# EAGLE design 411RoughDraft (EAGLE 9.5.1)
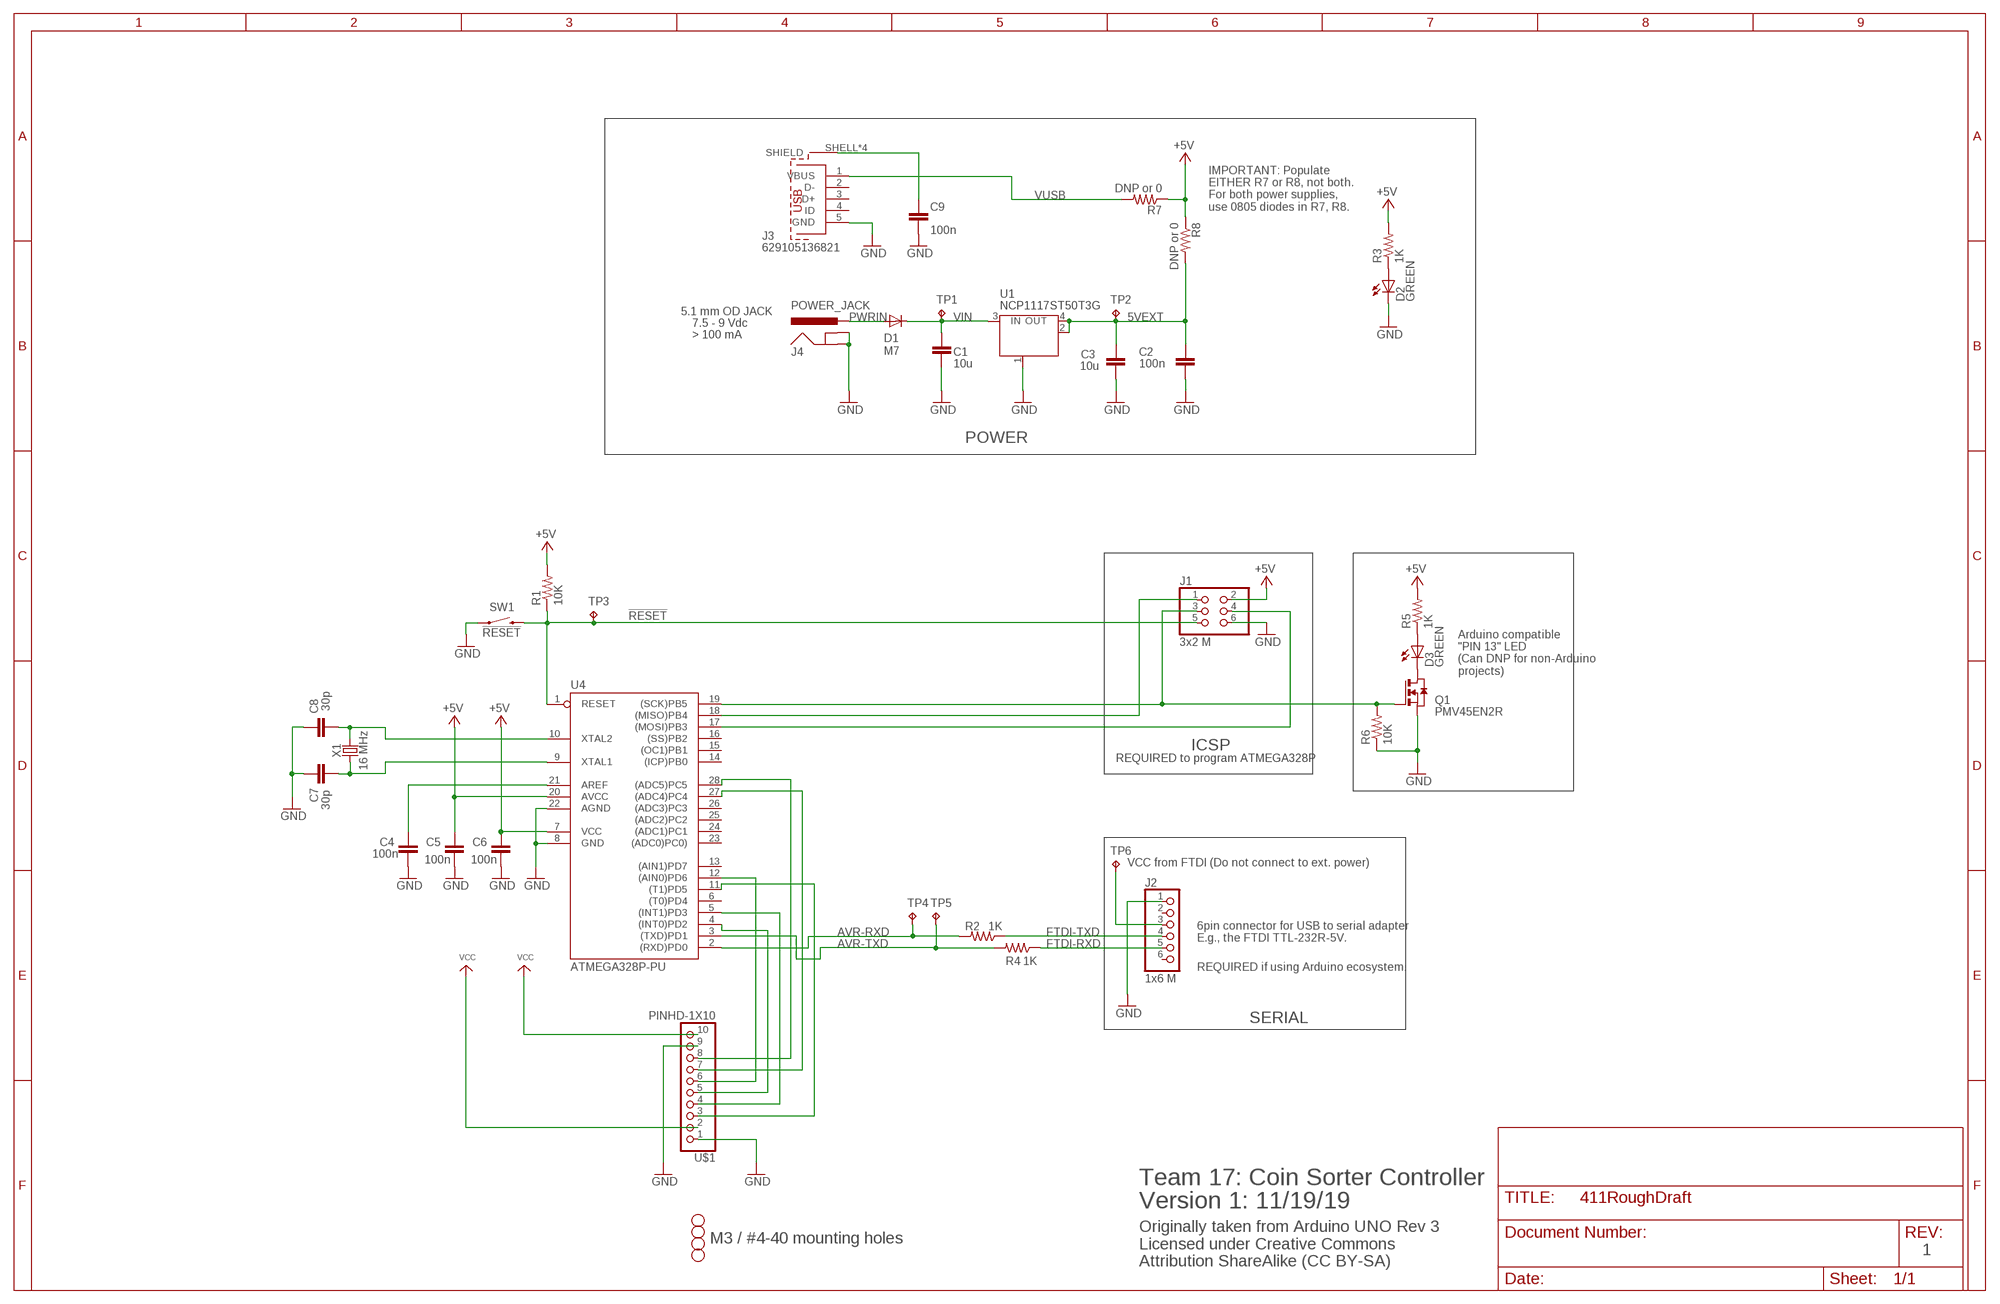
[diagram p0: schematic, sheet 1]

## Parts
C1  10u  C-EUC0805K  [C0805K]
C2  100n  C-EUC0805K  [C0805K]
C3  10u  C-EUC0805K  [C0805K]
C4  100n  C-EUC0805K  [C0805K]
C5  100n  C-EUC0805K  [C0805K]
C6  100n  C-EUC0805K  [C0805K]
C7  30p  C-EUC0805K  [C0805K]
C8  30p  C-EUC0805K  [C0805K]
C9  100n  C-EUC0805K  [C0805K]
D1  M7  DIODE-SMB  [SMB]
D2  GREEN  LEDCHIP-LED0805  [CHIP-LED0805]
D3  GREEN  LEDCHIP-LED0805  [CHIP-LED0805]
H1  STAND-OFF  [STAND-OFF]
H2  STAND-OFF  [STAND-OFF]
H3  STAND-OFF  [STAND-OFF]
H4  STAND-OFF  [STAND-OFF]
J1  3x2 M  PINHD-2X3  [2X03]
J2  1x6 M  PINHD-1X6  [1X06]
J3  629105136821  [629105136821]
J4  POWER_JACK  [POWER_JACK_PTH]
Q1  PMV45EN2R  NMOSSOT23  [SOT-23]
R1  10K  R-US_R0805  [R0805]
R2  1K  R-US_R0805  [R0805]
R3  1K  R-US_R0805  [R0805]
R4  1K  R-US_R0805  [R0805]
R5  1K  R-US_R0805  [R0805]
R6  10K  R-US_R0805  [R0805]
R7  DNP or 0  R-US_R0805  [R0805]
R8  DNP or 0  R-US_R0805  [R0805]
SW1  !RESET  SWITCH-MOMENTARY-2SMD  [TACTILE_SWITCH_SMD]
TP1  TPPAD1-13  [P1-13]
TP2  TPPAD1-13  [P1-13]
TP3  TPPAD1-13  [P1-13]
TP4  TPPAD1-13  [P1-13]
TP5  TPPAD1-13  [P1-13]
TP6  TPPAD1-13  [P1-13]
U1  NCP1117ST50T3G  MC33269ST-3.3T3  [SOT223]
U4  ATMEGA328P-PU  [DIL28-3]
U$1  PINHD-1X10  [1X10-BIG]
X1  16 MHz  CRYSTALSMD-HC49UP  [HC49UP]

## Nets
5VEXT: C2.2 C3.1 R8.2 TP2.TP U1.2(OUT) U1.4(OUT)
!RESET: J1.5 R1.1 SW1.3 TP3.TP U4.1(RESET)
+5V: C5.2 C6.2 J1.2 R1.2 R3.2 R5.2 R7.1 R8.1 U4.7(VCC) U4.20(AVCC)
AVR-RXD: R2.2 TP4.TP U4.2((RXD)PD0)
AVR-TXD: R4.2 TP5.TP U4.3((TXD)PD1)
FTDI-RXD: J2.5 R4.1
FTDI-TXD: J2.4 R2.1
GND: C1.2 C2.1 C3.2 C4.1 C5.1 C6.1 C7.2 C8.2 C9.1 D2.C J1.6 J2.1 J3.5(GND) J4.GND J4.GNDBREAK Q1.2(S) R6.1 SW1.1 U1.1(GND/ADJ) U4.8(GND) U4.22(AGND) U$1.1 U$1.9
MISO: J1.1 U4.18((MISO)PB4)
MOSI: J1.4 U4.17((MOSI)PB3)
N$1: C4.2 U4.21(AREF)
N$2: D3.A R5.1
N$3: D2.A R3.1
N$4: D3.C Q1.1(D)
N$5: J2.3 TP6.TP
N$6: C9.2 J3.SHELL1(SHIELD) J3.SHELL2(SHIELD) J3.SHELL3(SHIELD) J3.SHELL(SHIELD)
N$7: U4.27((ADC4)PC4) U$1.7
N$8: U4.12((AIN0)PD6) U$1.6
N$9: U4.4((INT0)PD2) U$1.5
N$10: U4.5((INT1)PD3) U$1.4
N$11: U4.28((ADC5)PC5) U$1.8
N$12: U4.11((T1)PD5) U$1.3
PWRIN: D1.A J4.PWR
SCK: J1.3 Q1.3(G) R6.2 U4.19((SCK)PB5)
VCC: U$1.2 U$1.10
VIN: C1.1 D1.C TP1.TP U1.3(IN)
VUSB: J3.1(VBUS) R7.2
XTAL1: C7.1 U4.9(XTAL1) X1.1
XTAL2: C8.1 U4.10(XTAL2) X1.2
Unconnected: J2.2 J2.6 J3.2(D-) J3.3(D+) J3.4(ID) U4.6((T0)PD4) U4.13((AIN1)PD7) U4.14((ICP)PB0) U4.15((OC1)PB1) U4.16((SS)PB2) U4.23((ADC0)PC0)) U4.24((ADC1)PC1) U4.25((ADC2)PC2) U4.26((ADC3)PC3)

## Notes on the sheet
- IMPORTANT: Populate 
  EITHER R7 or R8, not both.
  For both power supplies,
  use 0805 diodes in R7, R8.
- 5.1 mm OD JACK
- 7.5 - 9 Vdc
- > 100 mA
- POWER
- Arduino compatible
  "PIN 13" LED
  (Can DNP for non-Arduino
  projects)
- ICSP
- REQUIRED to program ATMEGA328P
- VCC from FTDI (Do not connect to ext. power)
- 6pin connector for USB to serial adapter
  E.g., the FTDI TTL-232R-5V.
- REQUIRED if using Arduino ecosystem.
- SERIAL
- Team 17: Coin Sorter Controller
- Version 1: 11/19/19
- M3 / #4-40 mounting holes
- 1
- Originally taken from Arduino UNO Rev 3
  Licensed under Creative Commons 
  Attribution ShareAlike (CC BY-SA)

## Library data of the parts
C1 C3 = rcl:C-EU: CAPACITOR, European symbol; MFR: Samsung; MPN: CL21A106KOQNNNG; SPICEPREFIX: C
C2 C4-C6 C9 = rcl:C-EU: CAPACITOR, European symbol; MFR: Samsung; MPN: CL21B104KBCNNNC; SPICEPREFIX: C
C7 = rcl:C-EU: CAPACITOR, European symbol; DESC: CAP CER 30PF 50V C0G/NP0 0805; MFR: Samsung; MPN: CL21C180JBANNNC; SPICEPREFIX: C
C8 = rcl:C-EU: CAPACITOR, European symbol; DESC: CAP CER 30PF 50V C0G/NP0 0805; MFR: Samsung; MPN: CL21C300JBANNNC; SPICEPREFIX: C
D1 = diode:DIODE-: DIODE; MFR: SMC Diode; MPN: 10BQ030TR
D2 D3 = led:LED: LED OSRAM: - CHIPLED LG R971, LG N971, LY N971, LG Q971, LY Q971, LO R971, LY R971 LH N974, LH R974 LS Q976, LO Q976, LY Q976 LO Q996 - Hyper CHIPLED LW Q18S LB Q993, LB Q99A, LB R99A - SideLED LS A670, LO A670, LY A670, LG A670, LP A670 LB A673, LV A673, LT A673, LW A673 LH A674 LY A675 LS A676, LA A676, LO A676, LY A676, LW A676 LS A679, LY A679, LG A679 - Hyper Micro SIDELED® LS Y876, LA Y876, LO Y876, LY Y876 LT Y87S - SmartLED LW L88C, LW L88S LB L89C, LB L89S, LG L890 LS L89K, LO L89K, LY L89K LS L896, LA L896, LO L896, LY L896 - TOPLED LS T670, LO T670, LY T670, LG T670, LP T670 LSG T670, LSP T670, LSY T670, LOP T670, LYG T670 LG T671, LOG T671, LSG T671 LB T673, LV T673, LT T673, LW T673 LH T674 LS T676, LA T676, LO T676, LY T676, LB T676, LH T676, LSB T676, LW T676 LB T67C, LV T67C, LT T67C, LS T67K, LO T67K, LY T67K, LW E67C LS E67B, LA E67B, LO E67B, LY E67B, LB E67C, LV E67C, LT E67C LW T67C LS T679, LY T679, LG T679 LS T770, LO T770, LY T770, LG T770, LP T770 LB T773, LV T773, LT T773, LW T773 LH T774 LS E675, LA E675, LY E675, LS T675 LS T776, LA T776, LO T776, LY T776, LB T776 LHGB T686 LT T68C, LB T68C - Hyper Mini TOPLED® LB M676 - Mini TOPLED Santana® LG M470 LS M47K, LO M47K, LY M47K Source: http://www.osram.convergy.de LUXEON: - LUMILED® LXK2-PW12-R00, LXK2-PW12-S00, LXK2-PW14-U00, LXK2-PW14-V00 LXK2-PM12-R00, LXK2-PM12-S00, LXK2-PM14-U00 LXK2-PE12-Q00, LXK2-PE12-R00, LXK2-PE12-S00, LXK2-PE14-T00, LXK2-PE14-U00 LXK2-PB12-K00, LXK2-PB12-L00, LXK2-PB12-M00, LXK2-PB14-N00, LXK2-PB14-P00, LXK2-PB14-Q00 LXK2-PR12-L00, LXK2-PR12-M00, LXK2-PR14-Q00, LXK2-PR14-R00 LXK2-PD12-Q00, LXK2-PD12-R00, LXK2-PD12-S00 LXK2-PH12-R00, LXK2-PH12-S00 LXK2-PL12-P00, LXK2-PL12-Q00, LXK2-PL12-R00 Source: www.luxeon.com KINGBRIGHT: KA-3528ASYC Source: www.kingbright.com; MFR: Würth Elektronik; MPN: 150080GS75000
H1-H4 = SparkFun-Hardware:STAND-OFF: Stand Off Drill holes for mechanically mounting via screws, standoffs, etc. Note: Use the keepout ring to avoid running the screw head into surrounding components. Variant Overviews STAND-OFF - Mechanical footprint for a #4 phillips button head screw. STAND-OFF-TIGHT - Mechanical footprint for a #4 phillips button head screw, Example SparkFun Products Screw - Phillips Head (1/4", 4-40, 10 pack) <https://www.sparkfun.com/products/10453> (PRT-10453) Screw - Phillips Head (1/2", 4-40, 10 pack) <https://www.sparkfun.com/products/10452> (PRT-10452) Screw - Phillips Head (3/4", 4-40, 10 pack) <https://www.sparkfun.com/products/10451> (PRT-10451) Screw - Phillips Head (1", 4-40, 10 pack) <https://www.sparkfun.com/products/10450> (PRT-10450)
J1 = SmartPrj:PINHD-2X3: PIN HEADER; MFR: Harwin; MPN: M20-9980345
J2 = pinhead:PINHD-1X6: PIN HEADER; MFR: Sullins; MPN: PRPC006SAAN-RC
J3 = Wurth_Elektronik_Electromechanic_Input-Output_Connectors_rev19b:629105136821: WR-COM SMT Horizontal 5 Contacts Micro USB Type B,5 pins=>Code : Con_I-O_COM_MicroUSB_629105136821 <http://katalog.we-online.de/media/images/eican/Con_I-O_COM_MicroUSB_629105136821_pf2.jpg> Details see: http://katalog.we-online.de/en/em/COM_MICRO_SMT_TYPE_B_HORIZONTAL/629105136821?m Created 2014-07-09, Karrer Zheng 2014 (C) Würth Elektronik; MFR: Wurth; MPN: 629105136821
J4 = SparkFun-Connectors:POWER_JACK: Power Jack Connector This is the standard 5.5mm barrel jack for power. The PTH is the most common, proven, reliable, footprint. The Slot footprint only works if the mill layer is transmitted to the PCB fab house so be warned. Here are the connectors we sell at SparkFun: DC Barrel Power Jack/Connector <https://www.sparkfun.com/products/119> (PRT-00119) DC Barrel Power Jack/Connector (SMD) <https://www.sparkfun.com/products/12748> (PRT-12748) DC Barrel Jack Adapter - Breadboard Compatible <https://www.sparkfun.com/products/10811> (PRT-10811) It is used on this SparkFun product (and many, many others): SparkFun RedBoard - Programmed with Arduino <https://www.sparkfun.com/products/12757> (DEV-12757) Also, if you need a mating power supply or connector, please check these out: Wall Adapter Power Supply - 9VDC 650mA <https://www.sparkfun.com/products/298> (TOL-00298) DC Barrel Jack Adapter - Male <https://www.sparkfun.com/products/10287> (PRT-10287); MFR: CUI; MPN: PJ-202A; PROD_ID: CONN-08197
Q1 = zetex:NMOSSOT23: MOS FET; MFR: Nexperia; MPN: PMV45EN2R; OC_FARNELL: unknown; OC_NEWARK: unknown
R1 R6 = rcl:R-US_: RESISTOR, American symbol; MFR: Yageo; MPN: RC0805FR-0710KL; SPICEPREFIX: R
R2-R5 = rcl:R-US_: RESISTOR, American symbol; MFR: Yageo; MPN: RC0805FR-071KL; SPICEPREFIX: R
R7 R8 = rcl:R-US_: RESISTOR, American symbol; MFR: Yageo; MPN: RC0805JR-070RL; SPICEPREFIX: R
SW1 = SparkFun-Electromechanical:SWITCH-MOMENTARY-2: Various NO switches- pushbuttons, reed, etc; DESC: SWITCH TACTILE SPST-NO 0.05A 12V; MFR: C&K; MPN: RS-187R05A2-DS MT RT
TP1-TP6 = testpad:TP: Test pad
U1 = linear:MC33269ST*: Adjustable Output Low Dropout Voltage Regulator 800 mA Source: http://www.onsemi.com/pub/Collateral/MC33269-D.PDF; MFR: ON Semiconductor; MPN: NCP1117ST50T3G
U4 = SmartPrj:ATMEGA328P-: MICROCONTROLLER 4 Kbytes FLASH 128 bytes SRAM 256 bytes EEPROM UART 6-channel 10 bit ADC; MFR: Microchip; MPN: ATMEGA328P-PU
U$1 = adafruit:PINHD-1X10: Pin header 1x10 0.1" spacing With round pins
X1 = SparkFun-Clocks:CRYSTAL: Crystals (Generic) These are passive quartz crystals, which can be used as a clock source for a microcontroller. Crystal's are two-terminal devices. They require external "load" capacitors to generate an oscillating signal.; DESC: CRYSTAL 16.000 MHZ 18PF SMD; MFR: ECS; MPN: ECS-160-18-5PX-TR

## Net classes
0 default: width 0.254 mm, clearance 0.254 mm

## Board
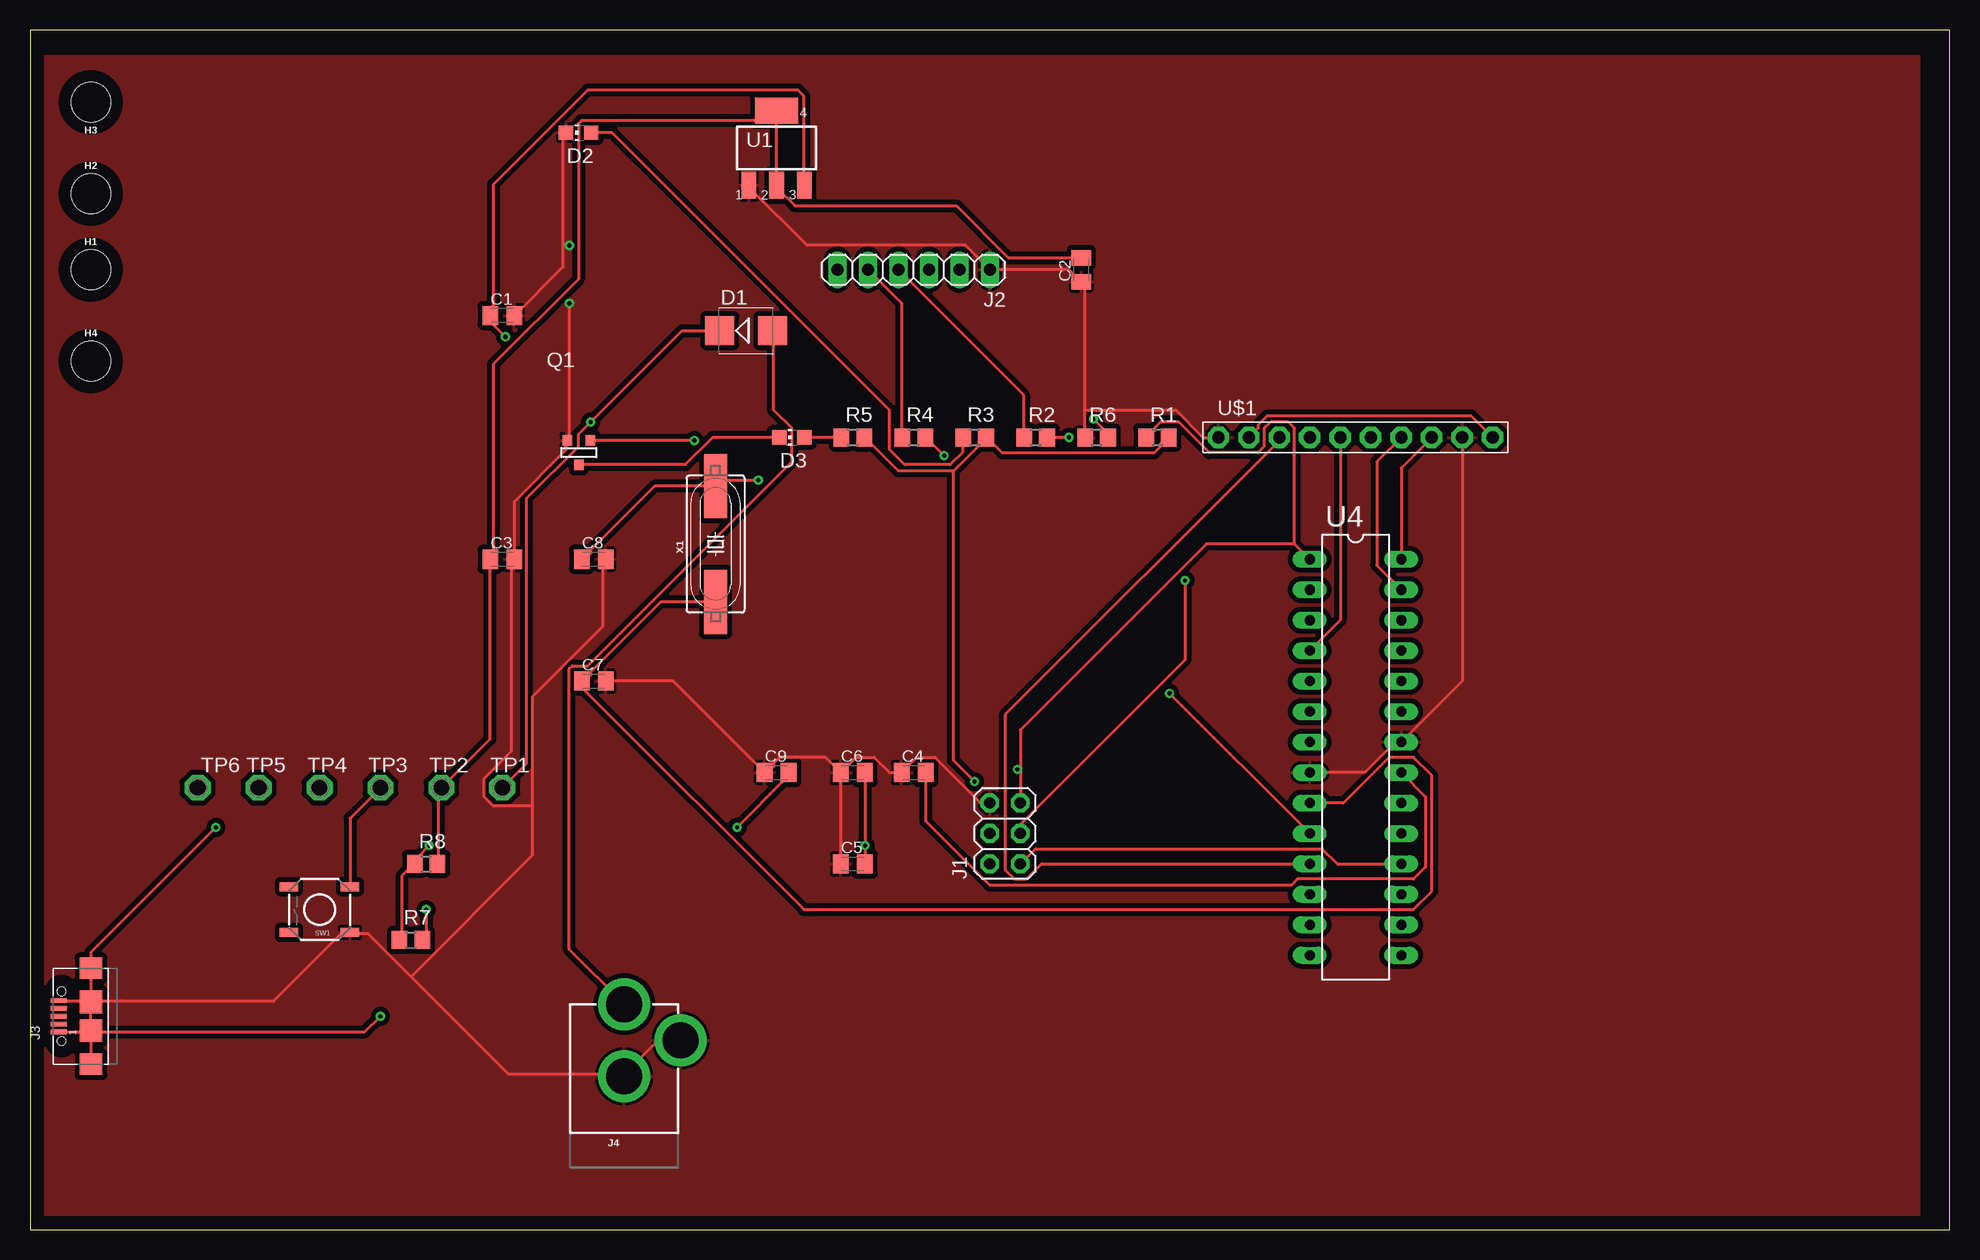
[diagram p1: board, top side]
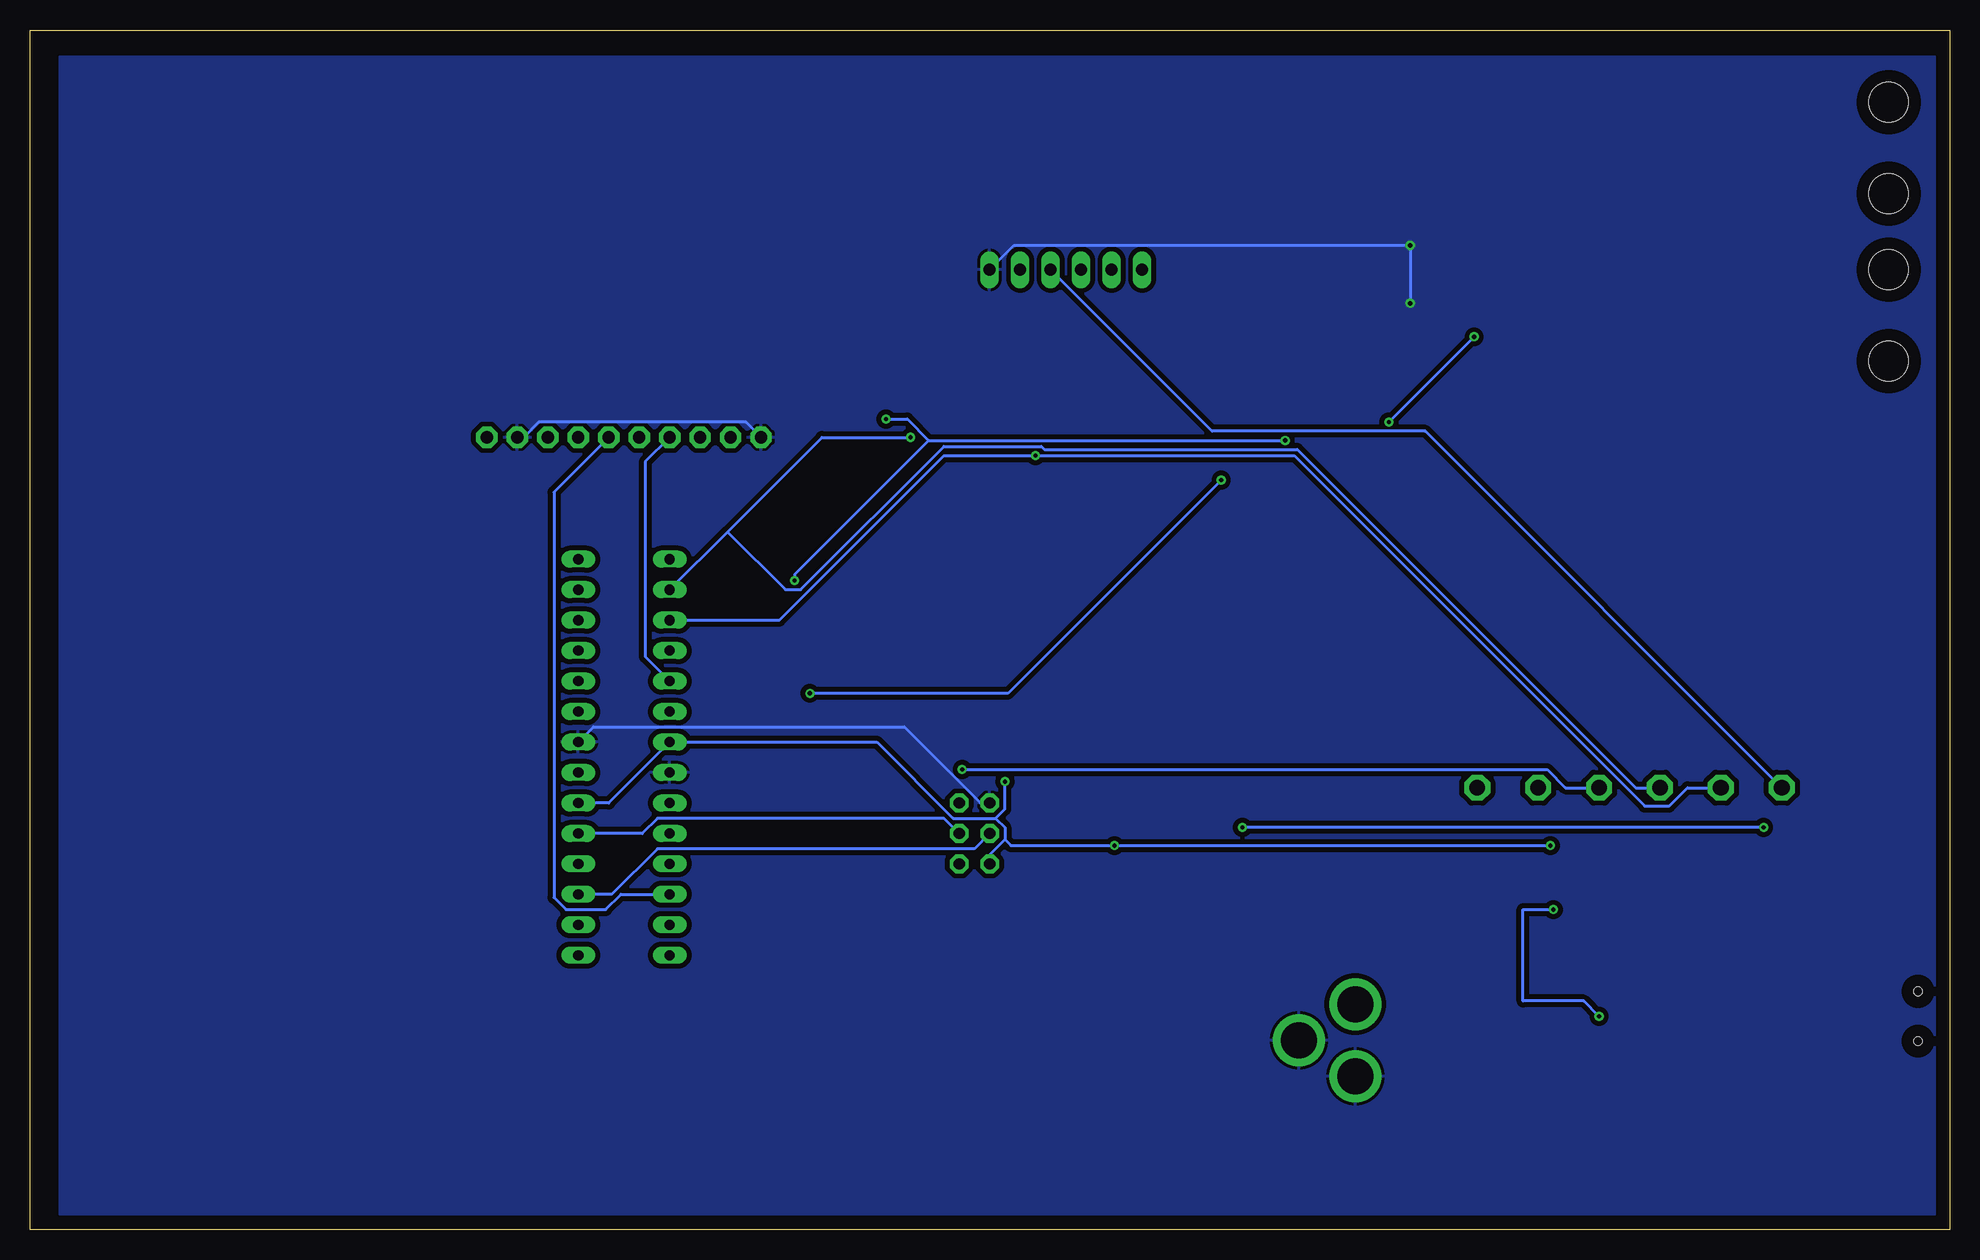
[diagram p2: board, bottom side, seen from below]

Size 160 x 100 mm. Coordinates in mm from the lower left corner, seen from the top.
Outline: 0,0 160,0 160,100 0,100 0,0
Copper layers (1*16): Top 0.035mm / dielectric 1.5mm / Bottom 0.035mm
Design rules "default": minimum track width 6mil, minimum drill 0.35mm, track to track 6mil, track to pad 6mil, pad to pad 6mil, via to via 6mil, smd to smd 6mil, copper to edge 40mil, drill to drill 6mil, minimum pad ring 10mil, minimum via ring 8mil, stop-mask expansion 4mil, vias tented up to drill 0mil, thermal gap 10mil

### Footprints (pad centres in the part's own frame; a part is rotated, then mirrored left to right if it is on the bottom)
C0805K = smd 1.3 x 1.6: 1 -1,0; 2 1,0
SMB = smd 2.4 x 2.4: A 2.2,0; C -2.2,0
CHIP-LED0805 = smd 1.2 x 1.2: A 0,-1.05; C 0,1.05
STAND-OFF = hole 3.302: 0,0
2X03 = drill 0.95 pad 1.55 octagon: 1 -2.54,-1.27; 2 -2.54,1.27; 3 0,-1.27; 4 0,1.27; 5 2.54,-1.27; 6 2.54,1.27
1X06 = drill 1.016 long: 1 -6.35,0; 2 -3.81,0; 3 -1.27,0; 4 1.27,0; 5 3.81,0; 6 6.35,0
629105136821 = smd 0.4 x 1.35: 1 -1.3,2.675; 2 -0.65,2.675; 3 0,2.675; 4 0.65,2.675; 5 1.3,2.675 | smd 1.8 x 1.9: SHELL -4,0; SHELL3 4,0 | smd 1.9 x 1.9: SHELL1 -1.2,0; SHELL2 1.2,0 | hole 0.7: -2.075,2.45; 2.075,2.45
POWER_JACK_PTH = drill 2.997 pad 4.318: GND 0,7.7; GNDBREAK 4.7,10.7; PWR 0,13.7
SOT-23 = smd 0.787 x 0.889: 1 0.025,-1.016; 2 -0.94,1.016; 3 0.991,1.016
R0805 = smd 1.3 x 1.5: 1 -0.95,0; 2 0.95,0
TACTILE_SWITCH_SMD = smd 1.524 x 0.762: 1 -2.54,1.905; 2 2.54,1.905; 3 -2.54,-1.905; 4 2.54,-1.905
P1-13 = drill 1.321 pad 2.159 octagon: TP 0,0
SOT223 = smd 1.219 x 2.235: 1 -2.311,-3.099; 2 0,-3.099; 3 2.311,-3.099 | smd 3.6 x 2.2: 4 0,3.099
DIL28-3 = drill 0.85 pad 1.422 long: 1 -16.51,-3.81; 2 -13.97,-3.81; 3 -11.43,-3.81; 4 -8.89,-3.81; 5 -6.35,-3.81; 6 -3.81,-3.81; 7 -1.27,-3.81; 8 1.27,-3.81; 9 3.81,-3.81; 10 6.35,-3.81; 11 8.89,-3.81; 12 11.43,-3.81; 13 13.97,-3.81; 14 16.51,-3.81; 15 16.51,3.81; 16 13.97,3.81; 17 11.43,3.81; 18 8.89,3.81; 19 6.35,3.81; 20 3.81,3.81; 21 1.27,3.81; 22 -1.27,3.81; 23 -3.81,3.81; 24 -6.35,3.81; 25 -8.89,3.81; 26 -11.43,3.81; 27 -13.97,3.81; 28 -16.51,3.81
1X10-BIG = drill 1.016 pad 1.778 octagon: 1 -11.43,0; 2 -8.89,0; 3 -6.35,0; 4 -3.81,0; 5 -1.27,0; 6 1.27,0; 7 3.81,0; 8 6.35,0; 9 8.89,0; 10 11.43,0
HC49UP = smd 5.334 x 1.93: 1 -4.826,0; 2 4.826,0

### Placement (x,y rotation side)
C1  39.37,76.2 0 top
C2  87.63,80.01 90 top
C3  39.37,55.88 0 top
C4  73.66,38.1 0 top
C5  68.58,30.48 0 top
C6  68.58,38.1 0 top
C7  46.99,45.72 0 top
C8  46.99,55.88 0 top
C9  62.23,38.1 0 top
D1  59.69,74.93 0 top
D2  45.72,91.44 90 top
D3  63.5,66.04 90 top
H1  5.08,80.01 0 top
H2  5.08,86.36 0 top
H3  5.08,93.98 180 top
H4  5.08,72.39 0 top
J1  81.28,33.02 90 top
J2  73.66,80.01 180 top
J3  5.08,17.78 90 top
J4  49.53,5.08 0 top
Q1  45.72,64.77 0 top
R1  93.98,66.04 0 top
R2  83.82,66.04 0 top
R3  78.74,66.04 0 top
R4  73.66,66.04 0 top
R5  68.58,66.04 0 top
R6  88.9,66.04 0 top
R7  31.75,24.13 0 top
R8  33.02,30.48 0 top
SW1  24.13,26.67 180 top
TP1  39.37,36.83 0 top
TP2  34.29,36.83 0 top
TP3  29.21,36.83 0 top
TP4  24.13,36.83 0 top
TP5  19.05,36.83 0 top
TP6  13.97,36.83 0 top
U1  62.23,90.17 0 top
U4  110.49,39.37 270 top
U$1  110.49,66.04 0 top
X1  57.15,57.15 90 top

### Tracks (layer width: path | path; a pad name or v marks a point on that pad's centre or on a via)
5VEXT
  Top 0.254: R8.2 34.04,30.48 34.04,36.58 TP2.TP 38.35,40.89 38.35,55.88 C3.1 38.61,55.88 38.61,72.14 45.72,79.25 45.72,92.2 45.97,92.46 62.23,92.46 | C2.2 87.63,81.03 81.53,81.03 77.22,85.34 63.75,85.34 62.23,86.87 U1.2 62.23,92.46 | 62.23,92.46 U1.4 62.23,93.22
!RESET  (via drill 0.35)
  Top 0.254: SW1.3 26.67,34.29 TP3.TP | 105.41,57.15 105.41,66.8 104.9,67.31 103.38,67.31 102.87,66.8 102.87,65.28 102.36,64.77 98.3,64.77 95.76,67.31 94.23,67.31 93.73,66.8 93.73,66.55 93.22,66.04 R1.1 | U4.1 105.41,57.15 | 82.55,38.35 82.55,41.66 98.04,57.15 105.41,57.15 | 82.55,38.35 J1.5 | 82.55,38.35 v82.3,38.35
  Bottom 0.254: TP3.TP 32,36.83 33.53,38.35 v82.3,38.35
+5V  (via drill 0.35)
  Top 0.254: 76.96,63.25 72.39,63.25 69.6,66.04 R5.2 | 79.76,66.04 76.96,63.25 | 79.76,66.04 81.03,64.77 93.73,64.77 94.23,65.28 94.23,65.53 94.74,66.04 R1.2 | 79.76,66.04 R3.2 | C5.2 69.6,30.48 v69.6,32 69.6,38.1 C6.2 | R7.1 30.99,24.13 30.99,29.46 32,30.48 R8.1 32.26,30.48 32.26,30.99 v33.27,32 | 76.96,63.25 76.96,39.12 v78.74,37.34
  Bottom 0.254: U4.20 111.76,35.56 U4.7 89.41,40.64 83.06,34.29 79.5,34.29 | J1.2 80.01,31.24 78.74,32.51 | 78.74,32.51 78.74,33.53 79.5,34.29 | v33.27,32 v69.6,32 78.23,32 78.74,32.51 | v78.74,37.34 78.74,35.05 79.5,34.29
AVR-RXD  (via drill 0.35)
  Top 0.254: v86.61,66.04 R2.2
  Bottom 0.254: v86.61,66.04 93.98,66.04 101.85,58.17 | U4.2 101.85,58.17 | TP4.TP 26.16,36.83 54.36,65.02 75.44,65.02 75.69,65.28 83.82,65.28 95.76,53.34 97.03,53.34 101.85,58.17
AVR-TXD  (via drill 0.35)
  Top 0.254: v76.2,64.52 74.68,66.04 R4.2
  Bottom 0.254: U4.3 97.54,50.8 83.82,64.52 v76.2,64.52 54.61,64.52 25.4,35.31 23.37,35.31 21.84,36.83 TP5.TP
FTDI-RXD
  Top 0.254: J2.5 72.64,77.22 72.64,66.04 R4.1
FTDI-TXD
  Top 0.254: J2.4 82.8,69.6 82.8,66.04 R2.1
GND  (via drill 0.35)
  Top 0.254: 26.67,24.64 28.19,24.64 31.75,21.08 | 31.75,21.08 39.88,12.95 49.53,12.95 | 26.67,24.64 SW1.1 | 41.91,35.31 41.91,31.24 31.75,21.08 | 41.91,35.31 41.91,44.45 47.75,50.29 47.75,55.88 C8.2 | 41.91,35.31 38.61,35.31 37.85,36.07 37.85,37.59 40.13,39.88 40.13,55.88 C3.2 40.39,55.88 40.39,60.71 44.7,65.02 44.7,65.79 Q1.2 44.96,65.79 v44.96,77.22 | 49.53,12.95 52.32,15.75 54.1,15.75 J4.GNDBREAK | 49.53,12.95 J4.GND | 44.45,82.04 44.45,80.26 40.39,76.2 C1.2 | 44.45,82.04 44.45,91.44 D2.C | U1.1 59.94,86.87 64.77,82.04 77.98,82.04 J2.1 86.61,80.01 87.63,78.99 | v44.96,82.04 44.45,82.04 | 67.56,38.1 66.29,39.37 62.48,39.37 61.98,38.86 61.98,38.61 61.47,38.1 C9.1 61.21,38.1 53.59,45.72 C7.2 | 67.56,38.1 67.56,30.48 C5.1 | 72.64,38.1 71.63,38.1 70.36,39.37 68.83,39.37 67.56,38.1 | 67.56,38.1 C6.1 | J1.6 79.25,35.56 75.44,39.37 73.91,39.37 72.64,38.1 | 72.64,38.1 C4.1 | U4.8 111.25,38.1 113.79,40.64 U4.22 119.38,45.72 U$1.9 | 87.88,68.33 87.88,78.74 87.63,78.99 | 87.88,68.33 87.88,66.04 R6.1 | U$1.1 97.79,66.04 95.5,68.33 87.88,68.33 | 87.63,78.99 C2.1 | J3.5 7.59,19.08 7.62,19.05 20.32,19.05 25.91,24.64 26.67,24.64
  Bottom 0.254: J2.1 77.98,82.04 v44.96,82.04 v44.96,77.22 | U$1.9 118.87,66.04 117.6,67.31 100.33,67.31 U$1.1 | J1.6 80.77,35.56 87.12,41.91 113.03,41.91 U4.22
  pour Top (isolate 0.406): 1.27,97.79 1.27,1.27 157.48,1.27 157.48,97.79
  pour Bottom (isolate 0.406): 1.27,97.79 1.27,1.27 157.48,1.27 157.48,97.79
MISO
  Top 0.254: U4.18 108.97,30.48 107.7,31.75 83.82,31.75 J1.1
MOSI
  Bottom 0.254: U4.17 111.51,27.94 107.7,31.75 81.28,31.75 J1.4
N$1
  Top 0.254: U4.21 116.33,36.07 116.33,30.23 115.32,29.21 105.66,29.21 105.16,28.7 80.01,28.7 74.68,34.04 74.68,38.1 C4.2
N$2
  Top 0.254: R5.1 D3.A
N$3
  Top 0.254: D2.A 48.51,91.44 71.63,68.33 71.63,65.02 72.9,63.75 76.71,63.75 77.72,64.77 77.72,66.04 R3.1
N$4
  Top 0.254: Q1.1 54.61,63.75 56.9,66.04 D3.C
N$5
  Bottom 0.254: J2.3 61.47,66.55 43.69,66.55 TP6.TP
N$6  (via drill 0.35)
  Top 0.254: J3.SHELL J3.SHELL1 J3.SHELL2 J3.SHELL3 5.08,23.11 v15.49,33.53 | v58.93,33.53 62.99,37.59 62.99,38.1 C9.2
  Bottom 0.254: v15.49,33.53 v58.93,33.53
N$7
  Top 0.254: U4.27 112.27,55.37 112.27,64.01 U$1.7
N$8
  Bottom 0.254: U4.12 110.74,27.94 112.01,26.67 115.32,26.67 116.33,27.69 116.33,61.47 U$1.6
N$9
  Top 0.254: U4.4 109.22,50.8 U$1.5
N$10
  Bottom 0.254: U4.5 108.71,47.75 108.71,64.01 U$1.4
N$11
  Top 0.254: U4.28 114.3,63.5 U$1.8
N$12
  Top 0.254: U4.11 84.33,30.48 83.06,29.21 82.04,29.21 81.28,29.97 81.28,42.93 104.14,65.79 U$1.3
PWRIN
  Top 0.254: D1.A 61.98,74.93 61.98,68.33 63.5,66.8 63.5,64.01 46.48,46.99 45.21,46.99 44.96,46.74 44.96,23.37 49.53,18.8 J4.PWR
SCK  (via drill 0.35)
  Top 0.254: v55.37,65.79 Q1.3 | v88.65,67.56 89.66,66.55 89.66,66.04 R6.2 | J1.3 82.55,33.78 96.27,47.5 v96.27,54.1
  Bottom 0.254: U4.19 108.97,33.02 107.7,34.29 83.82,34.29 J1.3 | 85.09,65.79 v55.37,65.79 | 85.09,65.79 86.87,67.56 v88.65,67.56 | v96.27,54.1 96.27,54.61 85.09,65.79
VCC
  Top 0.254: U$1.2 102.36,66.8 102.36,67.06 103.12,67.82 120.14,67.82 U$1.10
VIN  (via drill 0.35)
  Top 0.254: 38.61,76.2 38.61,87.12 46.48,95 64.01,95 64.52,94.49 64.52,87.12 U1.3 | D1.C 54.36,74.93 v46.74,67.31 45.72,66.29 45.72,65.28 41.4,60.96 41.4,38.86 TP1.TP | 38.61,76.2 38.61,75.44 v39.62,74.42 | 38.61,76.2 C1.1
  Bottom 0.254: v46.74,67.31 v39.62,74.42
VUSB  (via drill 0.35)
  Top 0.254: J3.1 27.91,16.48 v29.21,17.78 | v33.02,26.67 33.02,24.45 R7.2
  Bottom 0.254: v29.21,17.78 30.48,19.05 35.56,19.05 35.56,26.67 v33.02,26.67
XTAL1
  Top 0.254: 46.23,45.72 46.74,46.23 46.74,46.48 52.58,52.32 X1.1 | U4.9 109.47,35.56 113.28,39.37 115.32,39.37 116.84,37.85 116.84,28.19 115.32,26.67 64.52,26.67 46.23,44.96 46.23,45.72 | 46.23,45.72 C7.1
XTAL2  (via drill 0.35)
  Top 0.254: C8.1 46.23,55.88 46.74,56.39 46.74,56.64 52.07,61.98 X1.2 57.66,62.48 v60.71,62.48 | v95,44.7 U4.10
  Bottom 0.254: v95,44.7 78.49,44.7 v60.71,62.48